# Altium schematic sheet STM32F7.SchDoc: STM32F746NGH6 Connexion
size A3; Date: 25-FEB-2015; Author: A.B; CompanyName: STMicroelectronics; Address1: 12, Rue Jules HOROWITZ; Address2: 38019 Grenoble; Address3: FRANCE; DocumentNumber: MB1191; Revision: B-02; SheetNumber: 9; SheetTotal: 13; Project: STM32F746G-DISCO
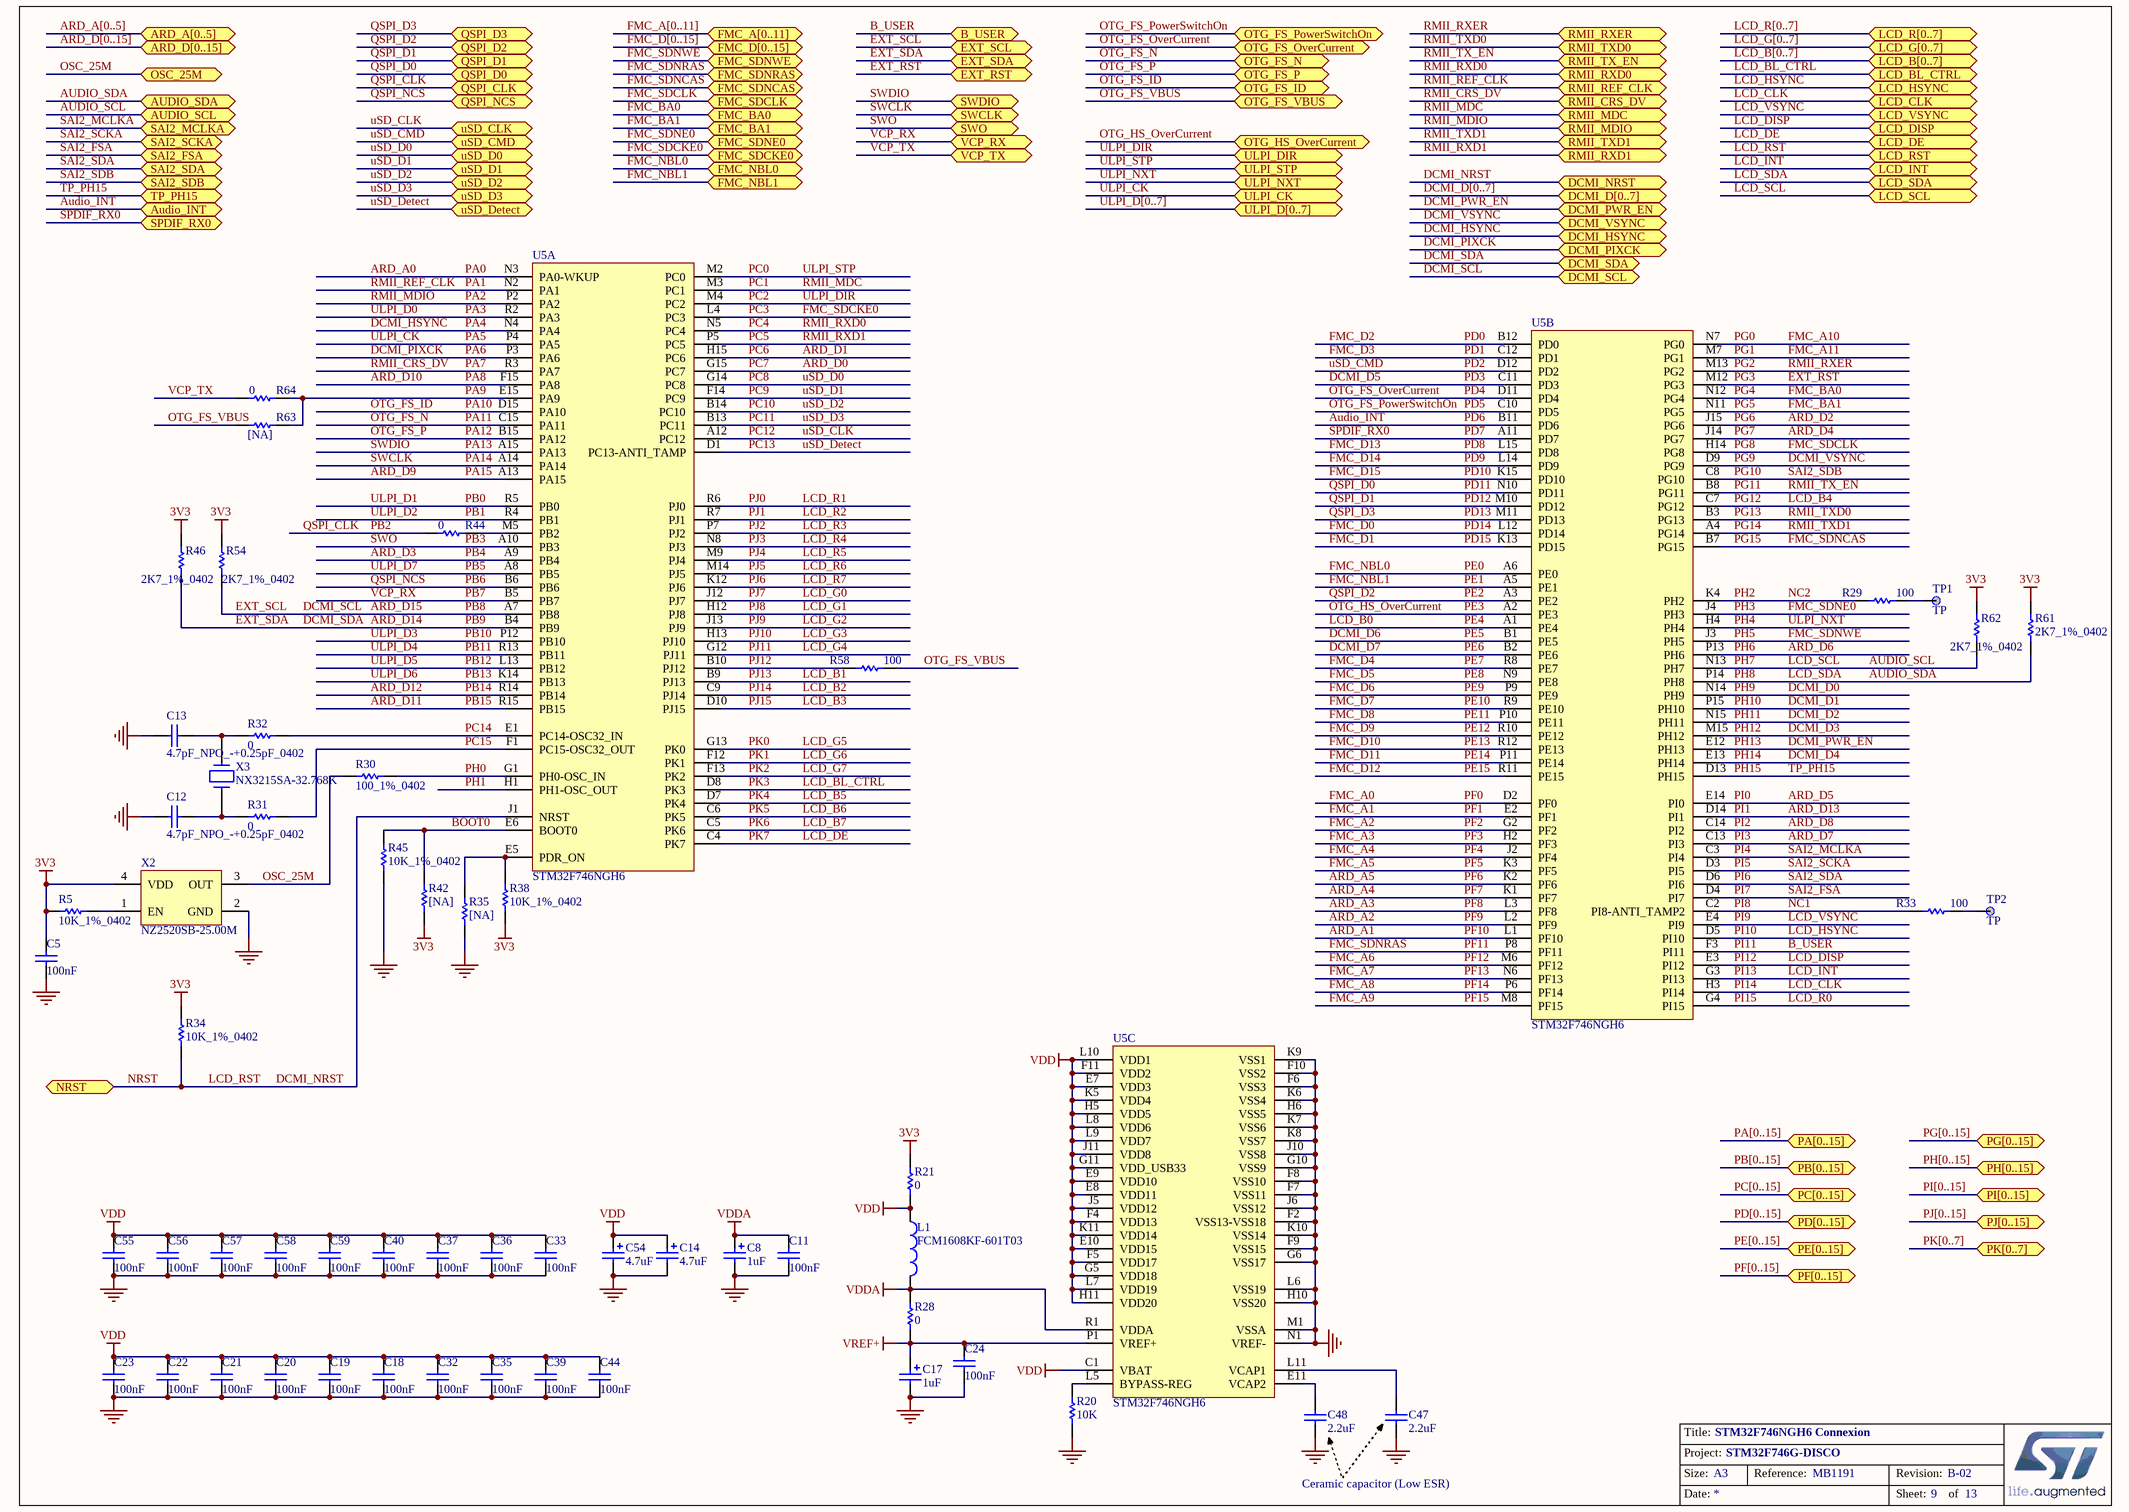
[diagram p0: STM32F7.SchDoc]

## Parts
C5  100nF  [0402C]
C8  1uF  [TAN-A]
C11  100nF  [0402C]
C12  4.7pF_NPO_-+0.25pF_0402  [0402C]
C13  4.7pF_NPO_-+0.25pF_0402  [0402C]
C14  4.7uF  [TAN-A]
C17  1uF  [TAN-A]
C18  100nF  [0402C]
C19  100nF  [0402C]
C20  100nF  [0402C]
C21  100nF  [0402C]
C22  100nF  [0402C]
C23  100nF  [0402C]
C24  100nF  [0402C]
C32  100nF  [0402C]
C33  100nF  [0402C]
C35  100nF  [0402C]
C36  100nF  [0402C]
C37  100nF  [0402C]
C39  100nF  [0402C]
C40  100nF  [0402C]
C44  100nF  [0402C]
C47  2.2uF  [1206C]
C48  2.2uF  [1206C]
C54  4.7uF  [TAN-A]
C55  100nF  [0402C]
C56  100nF  [0402C]
C57  100nF  [0402C]
C58  100nF  [0402C]
C59  100nF  [0402C]
L1  FCM1608KF-601T03  [0603L]
R5  10K_1%_0402  [0402R]
R20  10K  [0402R]
R21  0  [0603R-GS]
R28  0  [0603R-GS]
R29  100  [0402R]
R30  100_1%_0402  [0402R]
R31  0  [0402R]
R32  0  [0402R]
R33  100  [0402R]
R34  10K_1%_0402  [0402R]
R35  [NA]  [0402R]
R38  10K_1%_0402  [0402R]
R42  [NA]  [0402R]
R44  0  [0402R]
R45  10K_1%_0402  [0402R]
R46  2K7_1%_0402  [0402R]
R54  2K7_1%_0402  [0402R]
R58  100  [0402R]
R61  2K7_1%_0402  [0402R]
R62  2K7_1%_0402  [0402R]
R63  [NA]  [0402R]
R64  0  [0402R]
TP1  TP  [SMDTEST-1MM]
TP2  TP  [SMDTEST-1MM]
U5  STM32F746NGH6  [BGA216_0R8_13X13_SKT]  (parts A,B,C of 3)
X2  NZ2520SB-25.00M  [OSC_4SM_2R5X2R0]
X3  NX3215SA-32.768K  [XTAL_2SM_3R2X1R5]

## Ports
ARD_A[0..5], ARD_D[0..15], Audio_INT, AUDIO_SCL, AUDIO_SDA, B_USER, DCMI_D[0..7], DCMI_HSYNC, DCMI_NRST, DCMI_PIXCK, DCMI_PWR_EN, DCMI_SCL, DCMI_SDA, DCMI_VSYNC, EXT_RST, EXT_SCL, EXT_SDA, FMC_A[0..11], FMC_BA0, FMC_BA1, FMC_D[0..15], FMC_NBL0, FMC_NBL1, FMC_SDCKE0, FMC_SDCLK, FMC_SDNCAS, FMC_SDNE0, FMC_SDNRAS, FMC_SDNWE, LCD_B[0..7], LCD_BL_CTRL, LCD_CLK, LCD_DE, LCD_DISP, LCD_G[0..7], LCD_HSYNC, LCD_INT, LCD_R[0..7], LCD_RST, LCD_SCL, LCD_SDA, LCD_VSYNC, NRST, OSC_25M, OTG_FS_ID, OTG_FS_N, OTG_FS_OverCurrent, OTG_FS_P, OTG_FS_PowerSwitchOn, OTG_FS_VBUS, OTG_HS_OverCurrent, PA[0..15], PB[0..15], PC[0..15], PD[0..15], PE[0..15], PF[0..15], PG[0..15], PH[0..15], PI[0..15], PJ[0..15], PK[0..7], QSPI_CLK, QSPI_D0, QSPI_D1, QSPI_D2, QSPI_D3, QSPI_NCS, RMII_CRS_DV, RMII_MDC, RMII_MDIO, RMII_REF_CLK, RMII_RXD0, RMII_RXD1, RMII_RXER, RMII_TX_EN, RMII_TXD0, RMII_TXD1, SAI2_FSA, SAI2_MCLKA, SAI2_SCKA, SAI2_SDA, SAI2_SDB, SPDIF_RX0, SWCLK, SWDIO, SWO, TP_PH15, ULPI_CK, ULPI_D[0..7], ULPI_DIR, ULPI_NXT, ULPI_STP, uSD_CLK, uSD_CMD, uSD_D0, uSD_D1, uSD_D2, uSD_D3, uSD_Detect, VCP_RX, VCP_TX

## Nets
3V3: C5.2 R5.1 R21.2 R34.2 R38.1 R42.1 R46.2 R54.2 R61.2 R62.2 X2.4(VDD)
GND: C5.1 C8.2 C11.1 C12.1 C13.1 C14.2 C17.2 C18.1 C19.1 C20.1 C21.1 C22.1 C23.1 C24.1 C32.1 C33.1 C35.1 C36.1 C37.1 C39.1 C40.1 C44.1 C47.1 C48.1 C54.2 C55.1 C56.1 C57.1 C58.1 C59.1 R20.1 R35.1 R45.1 U5.F2(VSS13-VSS18) U5.F6(VSS3) U5.F7(VSS11) U5.F8(VSS10) U5.F9(VSS15) U5.F10(VSS2) U5.G6(VSS17) U5.G10(VSS9) U5.H6(VSS5) U5.H10(VSS20) U5.J6(VSS12) U5.J10(VSS8) U5.K6(VSS4) U5.K7(VSS6) U5.K8(VSS7) U5.K9(VSS1) U5.K10(VSS14) U5.L6(VSS19) U5.M1(VSSA) U5.N1(VREF-) X2.2(GND)
VDD: C14.1 C18.2 C19.2 C20.2 C21.2 C22.2 C23.2 C32.2 C33.2 C35.2 C36.2 C37.2 C39.2 C40.2 C44.2 C54.1 C55.2 C56.2 C57.2 C58.2 C59.2 L1.1 R21.1 U5.C1(VBAT) U5.E7(VDD3) U5.E8(VDD11) U5.E9(VDD10) U5.E10(VDD15) U5.F4(VDD13) U5.F5(VDD17) U5.F11(VDD2) U5.G5(VDD18) U5.G11(VDD_USB33) U5.H5(VDD5) U5.H11(VDD20) U5.J5(VDD12) U5.J11(VDD8) U5.K5(VDD4) U5.K11(VDD14) U5.L7(VDD19) U5.L8(VDD6) U5.L9(VDD7) U5.L10(VDD1)
VDDA: C8.1 C11.2 L1.2 R28.1 U5.R1(VDDA)
VREF+: C17.1 C24.2 R28.2 U5.P1(VREF+)
ARD_A0: U5.N3(PA0-WKUP)  [also labelled PA0]
ARD_A1: U5.L1(PF10)  [also labelled PF10]
ARD_A2: U5.L2(PF9)  [also labelled PF9]
ARD_A3: U5.L3(PF8)  [also labelled PF8]
ARD_A4: U5.K1(PF7)  [also labelled PF7]
ARD_A5: U5.K2(PF6)  [also labelled PF6]
ARD_D0: U5.G15(PC7)  [also labelled PC7]
ARD_D1: U5.H15(PC6)  [also labelled PC6]
ARD_D2: U5.J15(PG6)  [also labelled PG6]
ARD_D3: U5.A9(PB4)  [also labelled PB4]
ARD_D4: U5.J14(PG7)  [also labelled PG7]
ARD_D5: U5.E14(PI0)  [also labelled PI0]
ARD_D6: U5.P13(PH6)  [also labelled PH6]
ARD_D7: U5.C13(PI3)  [also labelled PI3]
ARD_D8: U5.C14(PI2)  [also labelled PI2]
ARD_D9: U5.A13(PA15)  [also labelled PA15]
ARD_D10: U5.F15(PA8)  [also labelled PA8]
ARD_D11: U5.R15(PB15)  [also labelled PB15]
ARD_D12: U5.R14(PB14)  [also labelled PB14]
ARD_D13: U5.D14(PI1)  [also labelled PI1]
ARD_D14: R46.1 U5.B4(PB9) ; port DCMI_SDA, port EXT_SDA  [also labelled DCMI_SDA, EXT_SDA, PB9]
ARD_D15: R54.1 U5.A7(PB8) ; port DCMI_SCL, port EXT_SCL  [also labelled DCMI_SCL, EXT_SCL, PB8]
Audio_INT: U5.B11(PD6) ; port Audio_INT  [also labelled PD6]
AUDIO_SCL: R62.1 U5.N13(PH7) ; port LCD_SCL, port AUDIO_SCL  [also labelled LCD_SCL, PH7]
AUDIO_SDA: R61.1 U5.P14(PH8) ; port LCD_SDA, port AUDIO_SDA  [also labelled LCD_SDA, PH8]
B_USER: U5.F3(PI11) ; port B_USER  [also labelled PI11]
BOOT0: R42.2 R45.2 U5.E6(BOOT0)
DCMI_D0: U5.N14(PH9)  [also labelled PH9]
DCMI_D1: U5.P15(PH10)  [also labelled PH10]
DCMI_D2: U5.N15(PH11)  [also labelled PH11]
DCMI_D3: U5.M15(PH12)  [also labelled PH12]
DCMI_D4: U5.E13(PH14)  [also labelled PH14]
DCMI_D5: U5.C11(PD3)  [also labelled PD3]
DCMI_D6: U5.B1(PE5)  [also labelled PE5]
DCMI_D7: U5.B2(PE6)  [also labelled PE6]
DCMI_HSYNC: U5.N4(PA4) ; port DCMI_HSYNC  [also labelled PA4]
DCMI_NRST: R34.1 U5.J1(NRST) ; port NRST, port LCD_RST, port DCMI_NRST  [also labelled LCD_RST, NRST]
DCMI_PIXCK: U5.P3(PA6) ; port DCMI_PIXCK  [also labelled PA6]
DCMI_PWR_EN: U5.E12(PH13) ; port DCMI_PWR_EN  [also labelled PH13]
DCMI_VSYNC: U5.D9(PG9) ; port DCMI_VSYNC  [also labelled PG9]
EXT_RST: U5.M12(PG3) ; port EXT_RST  [also labelled PG3]
FMC_A0: U5.D2(PF0)  [also labelled PF0]
FMC_A1: U5.E2(PF1)  [also labelled PF1]
FMC_A2: U5.G2(PF2)  [also labelled PF2]
FMC_A3: U5.H2(PF3)  [also labelled PF3]
FMC_A4: U5.J2(PF4)  [also labelled PF4]
FMC_A5: U5.K3(PF5)  [also labelled PF5]
FMC_A6: U5.M6(PF12)  [also labelled PF12]
FMC_A7: U5.N6(PF13)  [also labelled PF13]
FMC_A8: U5.P6(PF14)  [also labelled PF14]
FMC_A9: U5.M8(PF15)  [also labelled PF15]
FMC_A10: U5.N7(PG0)  [also labelled PG0]
FMC_A11: U5.M7(PG1)  [also labelled PG1]
FMC_BA0: U5.N12(PG4) ; port FMC_BA0  [also labelled PG4]
FMC_BA1: U5.N11(PG5) ; port FMC_BA1  [also labelled PG5]
FMC_D0: U5.L12(PD14)  [also labelled PD14]
FMC_D1: U5.K13(PD15)  [also labelled PD15]
FMC_D2: U5.B12(PD0)  [also labelled PD0]
FMC_D3: U5.C12(PD1)  [also labelled PD1]
FMC_D4: U5.R8(PE7)  [also labelled PE7]
FMC_D5: U5.N9(PE8)  [also labelled PE8]
FMC_D6: U5.P9(PE9)  [also labelled PE9]
FMC_D7: U5.R9(PE10)  [also labelled PE10]
FMC_D8: U5.P10(PE11)  [also labelled PE11]
FMC_D9: U5.R10(PE12)  [also labelled PE12]
FMC_D10: U5.R12(PE13)  [also labelled PE13]
FMC_D11: U5.P11(PE14)  [also labelled PE14]
FMC_D12: U5.R11(PE15)  [also labelled PE15]
FMC_D13: U5.L15(PD8)  [also labelled PD8]
FMC_D14: U5.L14(PD9)  [also labelled PD9]
FMC_D15: U5.K15(PD10)  [also labelled PD10]
FMC_NBL0: U5.A6(PE0) ; port FMC_NBL0  [also labelled PE0]
FMC_NBL1: U5.A5(PE1) ; port FMC_NBL1  [also labelled PE1]
FMC_SDCKE0: U5.L4(PC3) ; port FMC_SDCKE0  [also labelled PC3]
FMC_SDCLK: U5.H14(PG8) ; port FMC_SDCLK  [also labelled PG8]
FMC_SDNCAS: U5.B7(PG15) ; port FMC_SDNCAS  [also labelled PG15]
FMC_SDNE0: U5.J4(PH3) ; port FMC_SDNE0  [also labelled PH3]
FMC_SDNRAS: U5.P8(PF11) ; port FMC_SDNRAS  [also labelled PF11]
FMC_SDNWE: U5.J3(PH5) ; port FMC_SDNWE  [also labelled PH5]
LCD_B0: U5.A1(PE4)  [also labelled PE4]
LCD_B1: U5.B9(PJ13)  [also labelled PJ13]
LCD_B2: U5.C9(PJ14)  [also labelled PJ14]
LCD_B3: U5.D10(PJ15)  [also labelled PJ15]
LCD_B4: U5.C7(PG12)  [also labelled PG12]
LCD_B5: U5.D7(PK4)  [also labelled PK4]
LCD_B6: U5.C6(PK5)  [also labelled PK5]
LCD_B7: U5.C5(PK6)  [also labelled PK6]
LCD_BL_CTRL: U5.D8(PK3) ; port LCD_BL_CTRL  [also labelled PK3]
LCD_CLK: U5.H3(PI14) ; port LCD_CLK  [also labelled PI14]
LCD_DE: U5.C4(PK7) ; port LCD_DE  [also labelled PK7]
LCD_DISP: U5.E3(PI12) ; port LCD_DISP  [also labelled PI12]
LCD_G0: U5.J12(PJ7)  [also labelled PJ7]
LCD_G1: U5.H12(PJ8)  [also labelled PJ8]
LCD_G2: U5.J13(PJ9)  [also labelled PJ9]
LCD_G3: U5.H13(PJ10)  [also labelled PJ10]
LCD_G4: U5.G12(PJ11)  [also labelled PJ11]
LCD_G5: U5.G13(PK0)  [also labelled PK0]
LCD_G6: U5.F12(PK1)  [also labelled PK1]
LCD_G7: U5.F13(PK2)  [also labelled PK2]
LCD_HSYNC: U5.D5(PI10) ; port LCD_HSYNC  [also labelled PI10]
LCD_INT: U5.G3(PI13) ; port LCD_INT  [also labelled PI13]
LCD_R0: U5.G4(PI15)  [also labelled PI15]
LCD_R1: U5.R6(PJ0)  [also labelled PJ0]
LCD_R2: U5.R7(PJ1)  [also labelled PJ1]
LCD_R3: U5.P7(PJ2)  [also labelled PJ2]
LCD_R4: U5.N8(PJ3)  [also labelled PJ3]
LCD_R5: U5.M9(PJ4)  [also labelled PJ4]
LCD_R6: U5.M14(PJ5)  [also labelled PJ5]
LCD_R7: U5.K12(PJ6)  [also labelled PJ6]
LCD_VSYNC: U5.E4(PI9) ; port LCD_VSYNC  [also labelled PI9]
NC1: R33.1 U5.C2(PI8-ANTI_TAMP2)  [also labelled PI8]
NC2: R29.1 U5.K4(PH2)  [also labelled PH2]
OSC_25M: R30.1 X2.3(OUT) ; port OSC_25M
OTG_FS_ID: U5.D15(PA10) ; port OTG_FS_ID  [also labelled PA10]
OTG_FS_N: U5.C15(PA11) ; port OTG_FS_N  [also labelled PA11]
OTG_FS_OverCurrent: U5.D11(PD4) ; port OTG_FS_OverCurrent  [also labelled PD4]
OTG_FS_P: U5.B15(PA12) ; port OTG_FS_P  [also labelled PA12]
OTG_FS_PowerSwitchOn: U5.C10(PD5) ; port OTG_FS_PowerSwitchOn  [also labelled PD5]
OTG_FS_VBUS: R58.2 R63.1 ; port OTG_FS_VBUS
OTG_HS_OverCurrent: U5.A2(PE3) ; port OTG_HS_OverCurrent  [also labelled PE3]
PA1: U5.N2(PA1) ; port RMII_REF_CLK  [also labelled RMII_REF_CLK]
PA2: U5.P2(PA2) ; port RMII_MDIO  [also labelled RMII_MDIO]
PA3: U5.R2(PA3)  [also labelled ULPI_D0]
PA5: U5.P4(PA5) ; port ULPI_CK  [also labelled ULPI_CK]
PA7: U5.R3(PA7) ; port RMII_CRS_DV  [also labelled RMII_CRS_DV]
PA9: R63.2 R64.2 U5.E15(PA9)
PA13: U5.A15(PA13) ; port SWDIO  [also labelled SWDIO]
PA14: U5.A14(PA14) ; port SWCLK  [also labelled SWCLK]
PB0: U5.R5(PB0)  [also labelled ULPI_D1]
PB1: U5.R4(PB1)  [also labelled ULPI_D2]
PB2: R44.1 ; port QSPI_CLK  [also labelled QSPI_CLK]
PB3: U5.A10(PB3) ; port SWO  [also labelled SWO]
PB5: U5.A8(PB5)  [also labelled ULPI_D7]
PB6: U5.B6(PB6) ; port QSPI_NCS  [also labelled QSPI_NCS]
PB7: U5.B5(PB7) ; port VCP_RX  [also labelled VCP_RX]
PB10: U5.P12(PB10)  [also labelled ULPI_D3]
PB11: U5.R13(PB11)  [also labelled ULPI_D4]
PB12: U5.L13(PB12)  [also labelled ULPI_D5]
PB13: U5.K14(PB13)  [also labelled ULPI_D6]
PC0: U5.M2(PC0) ; port ULPI_STP  [also labelled ULPI_STP]
PC1: U5.M3(PC1) ; port RMII_MDC  [also labelled RMII_MDC]
PC2: U5.M4(PC2) ; port ULPI_DIR  [also labelled ULPI_DIR]
PC4: U5.N5(PC4) ; port RMII_RXD0  [also labelled RMII_RXD0]
PC5: U5.P5(PC5) ; port RMII_RXD1  [also labelled RMII_RXD1]
PC8: U5.G14(PC8) ; port uSD_D0  [also labelled uSD_D0]
PC9: U5.F14(PC9) ; port uSD_D1  [also labelled uSD_D1]
PC10: U5.B14(PC10) ; port uSD_D2  [also labelled uSD_D2]
PC11: U5.B13(PC11) ; port uSD_D3  [also labelled uSD_D3]
PC12: U5.A12(PC12) ; port uSD_CLK  [also labelled uSD_CLK]
PC13: U5.D1(PC13-ANTI_TAMP) ; port uSD_Detect  [also labelled uSD_Detect]
PC14: R32.2 U5.E1(PC14-OSC32_IN)
PC15: R31.2 U5.F1(PC15-OSC32_OUT)
PD2: U5.D12(PD2) ; port uSD_CMD  [also labelled uSD_CMD]
PD7: U5.A11(PD7) ; port SPDIF_RX0  [also labelled SPDIF_RX0]
PD11: U5.N10(PD11) ; port QSPI_D0  [also labelled QSPI_D0]
PD12: U5.M10(PD12) ; port QSPI_D1  [also labelled QSPI_D1]
PD13: U5.M11(PD13) ; port QSPI_D3  [also labelled QSPI_D3]
PE2: U5.A3(PE2) ; port QSPI_D2  [also labelled QSPI_D2]
PG2: U5.M13(PG2) ; port RMII_RXER  [also labelled RMII_RXER]
PG10: U5.C8(PG10) ; port SAI2_SDB  [also labelled SAI2_SDB]
PG11: U5.B8(PG11) ; port RMII_TX_EN  [also labelled RMII_TX_EN]
PG13: U5.B3(PG13) ; port RMII_TXD0  [also labelled RMII_TXD0]
PG14: U5.A4(PG14) ; port RMII_TXD1  [also labelled RMII_TXD1]
PH0: R30.2 U5.G1(PH0-OSC_IN)
PH1: U5.H1(PH1-OSC_OUT)
PH4: U5.H4(PH4) ; port ULPI_NXT  [also labelled ULPI_NXT]
PH15: U5.D13(PH15) ; port TP_PH15  [also labelled TP_PH15]
PI4: U5.C3(PI4) ; port SAI2_MCLKA  [also labelled SAI2_MCLKA]
PI5: U5.D3(PI5) ; port SAI2_SCKA  [also labelled SAI2_SCKA]
PI6: U5.D6(PI6) ; port SAI2_SDA  [also labelled SAI2_SDA]
PI7: U5.D4(PI7) ; port SAI2_FSA  [also labelled SAI2_FSA]
PJ12: R58.1 U5.B10(PJ12)
VCP_TX: R64.1 ; port VCP_TX
NetC12_2: C12.2 R31.1 X3.2
NetC13_2: C13.2 R32.1 X3.1
NetC47_2: C47.2 U5.L11(VCAP1)
NetC48_2: C48.2 U5.E11(VCAP2)
NetR5_2: R5.2 X2.1(EN)
NetR20_2: R20.2 U5.L5(BYPASS-REG)
NetR29_2: R29.2 TP1.1
NetR33_2: R33.2 TP2.1
NetR35_2: R35.2 R38.2 U5.E5(PDR_ON)
NetR44_2: R44.2 U5.M5(PB2)

## Buses and harness runs
bus ARD_A[0..5] = port ARD_A[0..5]
bus ARD_D[0..15] = port ARD_D[0..15]
bus DCMI_D[0..7] = port DCMI_D[0..7]
bus FMC_A[0..11] = port FMC_A[0..11]
bus FMC_D[0..15] = port FMC_D[0..15]
bus LCD_B[0..7] = port LCD_B[0..7]
bus LCD_G[0..7] = port LCD_G[0..7]
bus LCD_R[0..7] = port LCD_R[0..7]
bus PA[0..15] = port PA[0..15]
bus PB[0..15] = port PB[0..15]
bus PC[0..15] = port PC[0..15]
bus PD[0..15] = port PD[0..15]
bus PE[0..15] = port PE[0..15]
bus PF[0..15] = port PF[0..15]
bus PG[0..15] = port PG[0..15]
bus PH[0..15] = port PH[0..15]
bus PI[0..15] = port PI[0..15]
bus PJ[0..15] = port PJ[0..15]
bus PK[0..7] = port PK[0..7]
bus ULPI_D[0..7] = port ULPI_D[0..7]

## Notes on the sheet
- Ceramic capacitor (Low ESR)
- Title:
- Project:
- Size:
- Date:
- A3
- Reference:
- Sheet:
- Revision:
- of

## Library data of the parts
C5 C11 C18-C24 C32 C33 C35-C37 C39 C40 C44 C55-C59 = Cap_100nF_X7R_10%_0402: Capacitor,100nF,16V,X7R,10%,0402,YAGEO; Manuf_Part_1: CC0402KRX7R7BB104; Revision: July-2002: Re-released for DXP Platform.; Value: 100nF; Order: CC0402KRX7R7BB104; Manuf_1: YAGEO
C8 C17 = Cap_1uF_POL_10%_TANA: Polarized Capacitor,1uF,16V,10%,typeA,AVX; Manuf_Part_1: TAJA105K016R; Revision: July-2002: Re-released for DXP Platform.; Value: 1uF; Manuf_1: AVX; Distrib: *; Order: TAJA105K016R; ECCN_US/EU: n/a
C12 C13 = Cap_4.7pF_NPO_-+0.25pF_0402: Capacitor, 4.7pF, 50V, NPO, -+0.25pF, 0402, YAGEO; Manuf_Part_1: CC0402CRNPO9BN4R7; Order: 311-1367-2-ND; Revision: July-2002: Re-released for DXP Platform.; Value: 4.7pF; Manuf_1: YAGEO; ECCN_US/EU: n/a; Distrib: DIGIKEY
C14 C54 = Cap_4.7uF_POL_10%_TANA: Polarized Capacitor,4.7uF,16V,10%,typeA,AVX; Manuf_Part_1: TAJA475K016R; Revision: July-2002: Re-released for DXP Platform.; Value: 4.7uF; Manuf_1: AVX; Order: TAJA475K016R; ECCN_US/EU: n/a
C47 C48 = Cap_2.2uF_X7R_10%_1206: Capacitor,2.2uF,16V, X7R,10%,1206,YAGEO; Manuf_Part_1: CC1206KKX7R7BB225; Manuf_Part_2: C1206C225K4RAC; Manuf_2: KEMET; Revision: July-2002: Re-released for DXP Platform.; Value: 2.2uF; Order: CC1206KKX7R7BB225; Manuf_1: YAGEO; ECCN_US/EU: n/a
L1 = BEAD_600R_350MA_0603: Bead,600R,350mA,0603,FCM1608KF-601T03,Tai-tech; Manuf_2: TDK; Manuf_Part_2: MPZ1608S300A; Manuf_Part_3: BLM18PG121SN1D; Manuf_3: MURATA; Value: 100uH; Description_2: Bead,30R,5A,0603,MPZ1608S300A,TDK; Description_3: Bead,120R,2A,0603,BLM18PG121SN1D,MURATA; Revision: July-2002: Re-released for DXP Platform.; Manuf_Part_1: FCM1608KF-601T03; Manuf_1: Tai-tech; ECCN_US/EU: n/a
R5 R20 R34 R38 R45 = Res_10K_1%_0402: Resistor,10K,0402,1%,YAGEO; Manuf_Part_1: RC0402FR-0710KL; Value: 10K; Manuf_1: YAGEO; Order: RC0402FR-0710KL; ECCN_US/EU: n/a
R21 R28 = Res_0_5%_0603: Resistor,0,0603,5%,YAGEO; Manuf_Part_1: RC0603JR-070RL; Order: 2363481; Value: 0; ECCN_US/EU: n/a; Manuf_1: YAGEO; Distrib: FARNELL
R29 R33 R58 = Res_100_1%_0402: Resistor,100,0402,1%,YAGEO; Manuf_Part_1: RC0402FR-07100RL; Order: 9239111; Value: 100; Manuf_1: YAGEO; ECCN_US/EU: n/a; Distrib: FARNELL
R30 = Res_100_1%_0402: Resistor,100,0402,1%,YAGEO; Manuf_Part_1: RC0402FR-07100RL; Value: 100; Order: 9239111; Manuf_1: YAGEO; ECCN_US/EU: n/a; Distrib: FARNELL
R31 R32 R44 R64 = Res_0_5%_0402: Resistor,0,0402,5%,YAGEO; Manuf_Part_1: RC0402JR-070RL; Order: 2363467; Value: 0; ECCN_US/EU: n/a; Manuf_1: YAGEO; Distrib: FARNELL
R35 R42 R63 = Res_NA_0402: Resistor,[NA],0402; Fitted: NO; Value: [NA]; ECCN_US/EU: n/a
R46 R54 R61 R62 = Res_2K7_1%_0402: Resistor,2K7,0402,1%,YAGEO; Manuf_Part_1: RC0402FR-072K7L; Value: 2K7; Manuf_1: YAGEO; Order: RC0402FR-072K7L; ECCN_US/EU: n/a; Distrib: FARNELL
TP1 TP2 = TP: Test Point; Description: Test Point CMS; ECCN_US/EU: n/a
U5 = STM32F746NGH6U: STM32F746NGH6 (STM32F7 Birdie) TBGA216; Manuf_1: STM; ECCN_US/EU: 3A991A2/NEC; Ref St: 9175176; Provided: ST; Distrib: ST; Manuf_Part_1: STM32F746NGH6U; Order: STM32F746NGH6U
X2 = OSC_25M_NZ2520SB: Oscillator 25.00Mhz, -+50PPM, 3.3V, Temp -55 to +125°C; Manuf_Part_1: NZ2520SB 25MHz END4869B; Manuf_1: NDK; Manuf_Part_2: KC2520B25.0000C10E00; Manuf_2: AVX Corp/Kyocera Corp; ECCN_US/EU: EAR99/NEC; Ref St: 9157031; Provided: ST; Order: *
X3 = XTAL_32K_NX3215SA: Crystal 32.768kHz, 6pF, -+20PPM, R=50K, SMD; Manuf_1: NDK; Manuf_Part_1: NX3215SA 32.768KHz EXS00A-MU00525; Description: Crystal 32.768kHz, 6pF, -+20PPM, NDK only for ST, Type NX3215SA,  NDK Spec EXS00A-MU00525; ECCN_US/EU: EAR99/NEC; Ref St: 9157034; NDK Ref: X3101802; Provided: ST; Distrib: *; Order: NX3215SA 32.768KHz EXS00A-MU00525